# Altium schematic sheet Analog.SchDoc
size B; SheetNumber: 3; SheetTotal: 3
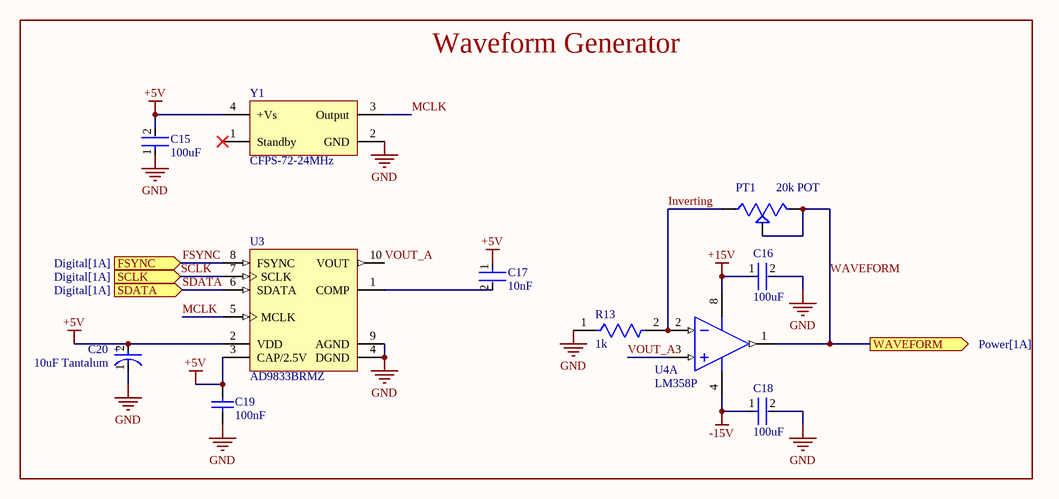
[diagram p0: Analog.SchDoc]

## Parts
C15  100uF  [FP-C1206C-EB-MFG]
C16  100uF  [FP-C1206C-EB-MFG]
C17  10nF  [FP-C0201-AB-MFG]
C18  100uF  [FP-C1206C-EB-MFG]
C19  100nF  [CAPC1608X87X45LL20T05]
C20  10uF Tantalum  [FP-293DB-MFG]
PT1  value 20k POT  [TRIM_PT01-D130K2-B203]  (hidden comment: PT01-D130K2-B203)
R13  1k  [FP-MCU0805-IPC_B]
U3  AD9833BRMZ  [ADI-RM-10_M]
U4  LM358P  [P0008A]  (part A of 2)
Y1  CFPS-72-24MHz  [WE-SPXO_CFPS-72]

## Blocks framed on the sheet
Waveform Generator: C15-C20 PT1 R13 U3 U4 Y1

## Ports
FSYNC (in, see Digital[1A]), SCLK (in, see Digital[1A]), SDATA (in, see Digital[1A]), WAVEFORM (out, see Power[1A])

## Nets
+5V: C15.2 C17.1 C19.2 C20.2(A) U3.2(VDD) U3.3(CAP/2.5V) Y1.4(+Vs)
+15V: C16.1 U4.8(VCC)
-15V: C18.1 U4.4(GND)
GND: C15.1 C16.2 C18.2 C19.1 C20.1(C) R13.1 U3.4(DGND) U3.9(AGND) Y1.2(GND)
FSYNC: U3.8(FSYNC) ; port FSYNC
Inverting: PT1.3 R13.2 U4.2(1IN-)
MCLK: U3.5(MCLK) Y1.3(Output)
SCLK: U3.7(SCLK) ; port SCLK
SDATA: U3.6(SDATA) ; port SDATA
VOUT_A: U3.10(VOUT) U4.3(1IN+)
WAVEFORM: PT1.1 PT1.2 U4.1(1OUT) ; port WAVEFORM
NetC17_2: C17.2 U3.1(COMP)

Not connected (* = marked no-connect by the designer): Y1 1(Standby)*

## Notes on the sheet
- (in symbol CMP-02414-000008-1) +

## Library data of the parts
C15 C16 C18 = CMP-03020-014955-1: C1206 0.10 μF C0G 10.00% 25 V X7R; Manufacturer: KEMET; Manufacturer Part Number: C1206C104K3GACTU; Automotive Grade: Grade 0; Voltage Rating: 25 V; Tolerance: 0.1; Material: Ceramic; Capacitance: 0.10 μF; Temperature Coefficient: 15%; Value: 0.10 μF; Category: Cap; RoHS: TRUE; Temperature Range High: +150°C; Mouser Description: Multilayer Ceramic Capacitors MLCC - SMD/SMT 25volt 0.1uF 10% C0G; Lead Free: Yes; Temperature Characteristic: C0G; Octopart: https://octopart.com/c1206c104k3gactu-kemet-12901041; Device Class L3: Ceramic Capacitors; Ipc Land Pattern Name: CAPC320160X78; Temperature Range Low: -55°C; Device Class L1: Passive Components; Temperature: -55°C to +150°C; Automotive: Yes; ComponentLink2Description: Datasheet; Device Class L2: Capacitors; ComponentLink2URL: https://content.kemet.com/datasheets/KEM_C1007_X8R_ULTRA_150C_SMD.pdf; Package: C1206C-EB; Height: 0.88mm
C17 = CMP-03020-034507-2: C0201 10,000 pF X5R 30ppm/°C 10.00% 10 V; Manufacturer Part Number: C0201C103K8PACTU; Manufacturer: KEMET; Standoff Height: 0mm; Voltage Rating: 10 V; Material: Ceramic; Tolerance: 0.1; RoHS: TRUE; Temperature Coefficient: 30ppm/°C; Temperature Characteristic: X5R; Device Class L1: Passive Components; ComponentLink2URL: https://content.kemet.com/datasheets/KEM_C1003_C0G_SMD.pdf; Temperature Range Low: -55°C; Temperature Range High: +125°C; Octopart: https://octopart.com/c0201c103k8pactu-kemet-65892557; Capacitance: 10,000 pF; Lead Free: Yes; Category: Cap; Package: C0201-AB; Temperature: -55°C to +125°C; Mouser Description: Multilayer Ceramic Capacitors MLCC - SMD/SMT 10volts 0.01uF 10%; Device Class L2: Capacitors; Device Class L3: Ceramic Capacitors; Value: 10,000 pF; Ipc Land Pattern Name: CAPC6030X30; Automotive: No; ComponentLink2Description: Datasheet; Height: 0.33mm
C19 = CMP-2006-00001-1: Ceramic 100nF X7R 16V 5%; Part Number: C0603X104J4RACTU; Manufacturer: Kemet
C20 = CMP-02414-000008-1: CAP TANT 10UF 10% 20V 1411; Leakage Current: 2uA; Dissipation Factor: 6%; Polarity: Polar; Ripple Current: 200mA; Q Factor: 6; ESR (Equivalent Series Resistance): 2.1R; Mount: Surface Mount; Case Code (Metric): 3528; Case/Package: 1411; Radiation Hardening: No; Package Quantity: 1; Case Code (Imperial): 1411; Packaging: Tape and Reel; Min Operating Temperature: -55°C; Voltage: 20V; Lead Free: Lead Free; Height: 1.9mm; Capacitance: 10uF; Construction: Flat; Voltage Rating: 20V; Termination: SMD/SMT; Series: TANTAMOUNT® 293D; Height - Seated (Max): 0.083inch; Width: 0.11inch; Voltage Rating (DC): 20V; Tolerance: 10%; RoHS Compliant: Yes; Depth: 2.8mm; Features: General Purpose; Length: 3.5mm; Dielectric Material: Tantalum; Max Operating Temperature: 125°C
PT1 = CMP-009-00177-1: Case/Package: None; Availability: Unavailable; Source: PT01-D130K2-B203.SchLib; Design Item ID: PT01-D130K2-B203; Price: None; MP: PT01-D130K2-B203; Component Type: Standard; Pins: 3
R13 = CMP-02407-004057-1: RES 1.05K OHM 0.5% 1/5W 0805
U3 = CMP-0293-00077-1: Low Power, 12.65 mW, 2.3 V to 5.5 V, Programmable Waveform Generator, 10-Bit, Serial, RM-10, 50 Tube, Pb-Free; Resolution (Bits): 10bit; Compliance Range (V): 650mV; FS Iout (mA nom): 3mA; REFCLK Multiplier: No; Master fclk: 25MHz; I Supply total (max): 5.5mA; Tuning Word Width (bits): 28bit; Code_JEDEC: MO-187-BA; DatasheetVersion: Rev. D; PackageVersion: 5/8/2005; ComponentLink1URL: www.analog.com; ComponentLink3Description: Package Specification; PackageDescription: 10-Lead Mini Small Outline Package [MSOP]; I/O Interface: Serial; ComponentLink2Description: Datasheet; ComponentLink1Description: Manufacturer URL; PackageReference: RM-10; ComponentLink2URL: http://www.analog.com/static/imported-files/data_sheets/AD9833.pdf; ComponentLink3URL: http://www.analog.com/static/imported-files/packages/PKG_PDF/MSOP%28RM%29/RM_10.pdf
U4 = CMP-2000-06549-1: Dual Operational Amplifier, 3 to 32 V, 0 to 70 degC, 8-Pin PDIP (P), RoHS, Tape and Reel; Manufacturer: Technik Industrial; Datasheet Version: Rev. T, 04/2015; Datasheet URL: http://www.ti.com/lit/ds/symlink/lm358.pdf; Manufacturer URL: http://www.technik.com.hk/; Package Description: 8-Pin Double In-line Package, Body 9.59 x 6.35 mm, Pitch 2.54 mm; Mounting Technology: ThroughHole; Package URL: http://www.ti.com/lit/ml/mpdi001b/mpdi001b.pdf; Package Reference: P8
Y1 = CMP-03913-116855899-1: 831019082 WE-SPXO Crystal Oscillator; Frequency: 24MHz; Max Operating Temperature: 70°C; Height: 1.4mm; Min Operating Temperature: 0°C; Length: 7mm; Width: 5mm; NexarPartId: 116855899